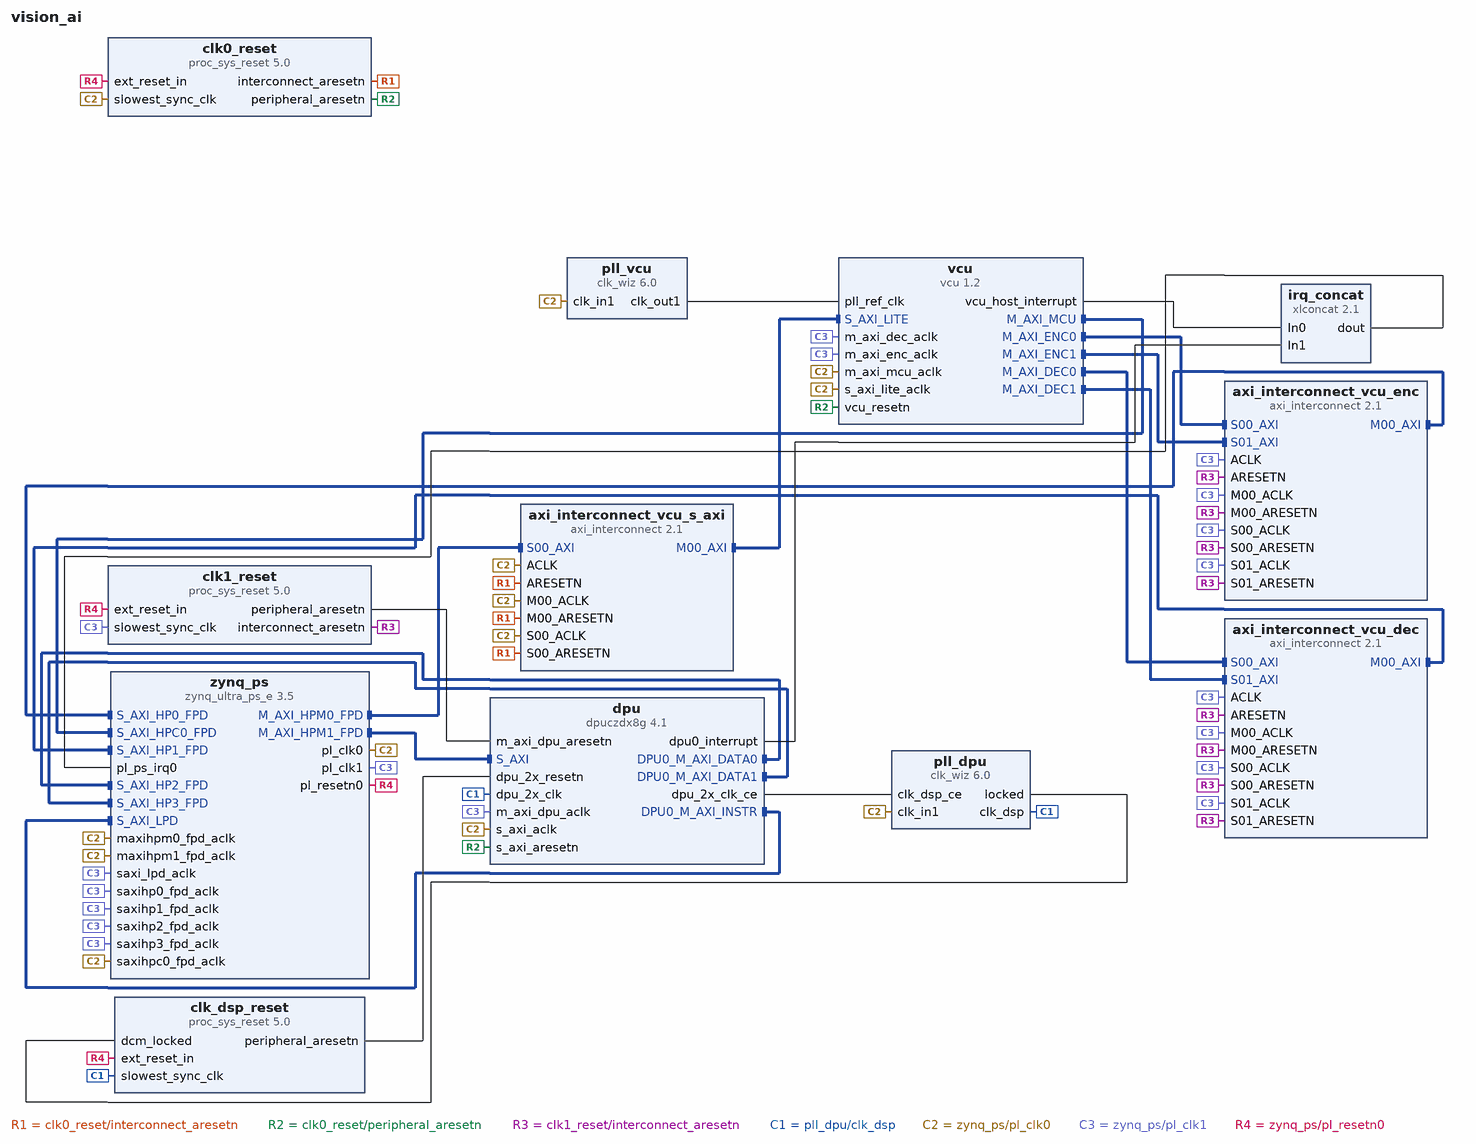
[diagram p0: block diagram of the top level]
# Vivado block design vision_ai, xck26-sfvc784-2LV-c, Vivado 2023.1
create_bd_design vision_ai

create_bd_cell -type ip -vlnv xilinx.com:ip:zynq_ultra_ps_e:3.5 zynq_ps
set_property -dict [list \
  CONFIG.PSU_BANK_0_IO_STANDARD LVCMOS18 \
  CONFIG.PSU_BANK_1_IO_STANDARD LVCMOS18 \
  CONFIG.PSU_BANK_2_IO_STANDARD LVCMOS18 \
  CONFIG.PSU_BANK_3_IO_STANDARD LVCMOS18 \
  CONFIG.PSU_USB3__DUAL_CLOCK_ENABLE 1 \
  CONFIG.PSU__CAN1__PERIPHERAL__ENABLE 0 \
  CONFIG.PSU__CRF_APB__ACPU_CTRL__FREQMHZ 1333.333 \
  CONFIG.PSU__CRF_APB__ACPU_CTRL__SRCSEL APLL \
  CONFIG.PSU__CRF_APB__APLL_CTRL__SRCSEL PSS_REF_CLK \
  CONFIG.PSU__CRF_APB__APLL_FRAC_CFG__ENABLED 1 \
  CONFIG.PSU__CRF_APB__DBG_FPD_CTRL__FREQMHZ 250 \
  CONFIG.PSU__CRF_APB__DBG_FPD_CTRL__SRCSEL IOPLL \
  CONFIG.PSU__CRF_APB__DBG_TRACE_CTRL__FREQMHZ 250 \
  CONFIG.PSU__CRF_APB__DBG_TRACE_CTRL__SRCSEL IOPLL \
  CONFIG.PSU__CRF_APB__DBG_TSTMP_CTRL__FREQMHZ 250 \
  CONFIG.PSU__CRF_APB__DBG_TSTMP_CTRL__SRCSEL IOPLL \
  CONFIG.PSU__CRF_APB__DDR_CTRL__FREQMHZ 1200 \
  CONFIG.PSU__CRF_APB__DDR_CTRL__SRCSEL DPLL \
  CONFIG.PSU__CRF_APB__DPDMA_REF_CTRL__FREQMHZ 600 \
  CONFIG.PSU__CRF_APB__DPDMA_REF_CTRL__SRCSEL APLL \
  CONFIG.PSU__CRF_APB__DPLL_CTRL__SRCSEL PSS_REF_CLK \
  CONFIG.PSU__CRF_APB__DP_AUDIO_REF_CTRL__SRCSEL RPLL \
  CONFIG.PSU__CRF_APB__DP_STC_REF_CTRL__SRCSEL RPLL \
  CONFIG.PSU__CRF_APB__DP_VIDEO_REF_CTRL__SRCSEL VPLL \
  CONFIG.PSU__CRF_APB__GDMA_REF_CTRL__FREQMHZ 600 \
  CONFIG.PSU__CRF_APB__GDMA_REF_CTRL__SRCSEL DPLL \
  CONFIG.PSU__CRF_APB__GPU_REF_CTRL__FREQMHZ 600 \
  CONFIG.PSU__CRF_APB__GPU_REF_CTRL__SRCSEL IOPLL \
  CONFIG.PSU__CRF_APB__TOPSW_LSBUS_CTRL__FREQMHZ 100 \
  CONFIG.PSU__CRF_APB__TOPSW_LSBUS_CTRL__SRCSEL IOPLL \
  CONFIG.PSU__CRF_APB__TOPSW_MAIN_CTRL__FREQMHZ 533.33 \
  CONFIG.PSU__CRF_APB__TOPSW_MAIN_CTRL__SRCSEL DPLL \
  CONFIG.PSU__CRF_APB__VPLL_CTRL__SRCSEL PSS_REF_CLK \
  CONFIG.PSU__CRL_APB__ADMA_REF_CTRL__FREQMHZ 500 \
  CONFIG.PSU__CRL_APB__ADMA_REF_CTRL__SRCSEL IOPLL \
  CONFIG.PSU__CRL_APB__CAN1_REF_CTRL__SRCSEL IOPLL \
  CONFIG.PSU__CRL_APB__CPU_R5_CTRL__FREQMHZ 533.333 \
  CONFIG.PSU__CRL_APB__CPU_R5_CTRL__SRCSEL RPLL \
  CONFIG.PSU__CRL_APB__DBG_LPD_CTRL__FREQMHZ 250 \
  CONFIG.PSU__CRL_APB__DBG_LPD_CTRL__SRCSEL IOPLL \
  CONFIG.PSU__CRL_APB__GEM3_REF_CTRL__FREQMHZ 125 \
  CONFIG.PSU__CRL_APB__GEM3_REF_CTRL__SRCSEL IOPLL \
  CONFIG.PSU__CRL_APB__I2C1_REF_CTRL__FREQMHZ 100 \
  CONFIG.PSU__CRL_APB__I2C1_REF_CTRL__SRCSEL IOPLL \
  CONFIG.PSU__CRL_APB__IOPLL_CTRL__SRCSEL PSS_REF_CLK \
  CONFIG.PSU__CRL_APB__IOU_SWITCH_CTRL__FREQMHZ 250 \
  CONFIG.PSU__CRL_APB__IOU_SWITCH_CTRL__SRCSEL IOPLL \
  CONFIG.PSU__CRL_APB__LPD_LSBUS_CTRL__FREQMHZ 100 \
  CONFIG.PSU__CRL_APB__LPD_LSBUS_CTRL__SRCSEL IOPLL \
  CONFIG.PSU__CRL_APB__LPD_SWITCH_CTRL__FREQMHZ 500 \
  CONFIG.PSU__CRL_APB__LPD_SWITCH_CTRL__SRCSEL IOPLL \
  CONFIG.PSU__CRL_APB__PCAP_CTRL__FREQMHZ 200 \
  CONFIG.PSU__CRL_APB__PCAP_CTRL__SRCSEL IOPLL \
  CONFIG.PSU__CRL_APB__PL0_REF_CTRL__FREQMHZ 100 \
  CONFIG.PSU__CRL_APB__PL0_REF_CTRL__SRCSEL IOPLL \
  CONFIG.PSU__CRL_APB__PL1_REF_CTRL__FREQMHZ 250 \
  CONFIG.PSU__CRL_APB__PL1_REF_CTRL__SRCSEL IOPLL \
  CONFIG.PSU__CRL_APB__QSPI_REF_CTRL__FREQMHZ 125 \
  CONFIG.PSU__CRL_APB__QSPI_REF_CTRL__SRCSEL IOPLL \
  CONFIG.PSU__CRL_APB__RPLL_CTRL__SRCSEL PSS_REF_CLK \
  CONFIG.PSU__CRL_APB__SDIO1_REF_CTRL__FREQMHZ 200 \
  CONFIG.PSU__CRL_APB__SDIO1_REF_CTRL__SRCSEL IOPLL \
  CONFIG.PSU__CRL_APB__SPI1_REF_CTRL__SRCSEL IOPLL \
  CONFIG.PSU__CRL_APB__TIMESTAMP_REF_CTRL__FREQMHZ 100 \
  CONFIG.PSU__CRL_APB__TIMESTAMP_REF_CTRL__SRCSEL IOPLL \
  CONFIG.PSU__CRL_APB__UART1_REF_CTRL__FREQMHZ 100 \
  CONFIG.PSU__CRL_APB__UART1_REF_CTRL__SRCSEL IOPLL \
  CONFIG.PSU__CRL_APB__USB0_BUS_REF_CTRL__FREQMHZ 250 \
  CONFIG.PSU__CRL_APB__USB0_BUS_REF_CTRL__SRCSEL IOPLL \
  CONFIG.PSU__CRL_APB__USB3_DUAL_REF_CTRL__FREQMHZ 20 \
  CONFIG.PSU__CRL_APB__USB3_DUAL_REF_CTRL__SRCSEL IOPLL \
  CONFIG.PSU__CRL_APB__USB3__ENABLE 1 \
  CONFIG.PSU__CSUPMU__PERIPHERAL__VALID 1 \
  CONFIG.PSU__DDRC__BUS_WIDTH {64 Bit} \
  CONFIG.PSU__DDRC__COMPONENTS Components \
  CONFIG.PSU__DDRC__DEVICE_CAPACITY {8192 MBits} \
  CONFIG.PSU__DDRC__DRAM_WIDTH {16 Bits} \
  CONFIG.PSU__DDRC__ECC Disabled \
  CONFIG.PSU__DDRC__MEMORY_TYPE {DDR 4} \
  CONFIG.PSU__DDRC__SPEED_BIN DDR4_2400R \
  CONFIG.PSU__DDR_HIGH_ADDRESS_GUI_ENABLE 1 \
  CONFIG.PSU__DDR__INTERFACE__FREQMHZ 600.000 \
  CONFIG.PSU__DISPLAYPORT__LANE0__ENABLE 1 \
  CONFIG.PSU__DISPLAYPORT__LANE0__IO {GT Lane1} \
  CONFIG.PSU__DISPLAYPORT__LANE1__ENABLE 1 \
  CONFIG.PSU__DISPLAYPORT__LANE1__IO {GT Lane0} \
  CONFIG.PSU__DISPLAYPORT__PERIPHERAL__ENABLE 1 \
  CONFIG.PSU__DLL__ISUSED 1 \
  CONFIG.PSU__DPAUX__PERIPHERAL__ENABLE 1 \
  CONFIG.PSU__DPAUX__PERIPHERAL__IO {MIO 27 .. 30} \
  CONFIG.PSU__DP__LANE_SEL {Dual Lower} \
  CONFIG.PSU__DP__REF_CLK_FREQ 27 \
  CONFIG.PSU__DP__REF_CLK_SEL {Ref Clk0} \
  CONFIG.PSU__ENET3__FIFO__ENABLE 0 \
  CONFIG.PSU__ENET3__GRP_MDIO__ENABLE 1 \
  CONFIG.PSU__ENET3__GRP_MDIO__IO {MIO 76 .. 77} \
  CONFIG.PSU__ENET3__PERIPHERAL__ENABLE 1 \
  CONFIG.PSU__ENET3__PERIPHERAL__IO {MIO 64 .. 75} \
  CONFIG.PSU__ENET3__PTP__ENABLE 0 \
  CONFIG.PSU__ENET3__TSU__ENABLE 0 \
  CONFIG.PSU__FPGA_PL0_ENABLE 1 \
  CONFIG.PSU__FPGA_PL1_ENABLE 1 \
  CONFIG.PSU__GEM3_COHERENCY 0 \
  CONFIG.PSU__GEM3_ROUTE_THROUGH_FPD 0 \
  CONFIG.PSU__GEM__TSU__ENABLE 0 \
  CONFIG.PSU__GPIO0_MIO__IO {MIO 0 .. 25} \
  CONFIG.PSU__GPIO0_MIO__PERIPHERAL__ENABLE 1 \
  CONFIG.PSU__GPIO1_MIO__IO {MIO 26 .. 51} \
  CONFIG.PSU__GPIO1_MIO__PERIPHERAL__ENABLE 1 \
  CONFIG.PSU__GT__LINK_SPEED HBR \
  CONFIG.PSU__GT__PRE_EMPH_LVL_4 0 \
  CONFIG.PSU__GT__VLT_SWNG_LVL_4 0 \
  CONFIG.PSU__I2C0__PERIPHERAL__ENABLE 0 \
  CONFIG.PSU__I2C1__PERIPHERAL__ENABLE 1 \
  CONFIG.PSU__I2C1__PERIPHERAL__IO {MIO 24 .. 25} \
  CONFIG.PSU__IOU_SLCR__IOU_TTC_APB_CLK__TTC0_SEL APB \
  CONFIG.PSU__IOU_SLCR__IOU_TTC_APB_CLK__TTC1_SEL APB \
  CONFIG.PSU__IOU_SLCR__IOU_TTC_APB_CLK__TTC2_SEL APB \
  CONFIG.PSU__IOU_SLCR__IOU_TTC_APB_CLK__TTC3_SEL APB \
  CONFIG.PSU__MAXIGP0__DATA_WIDTH 32 \
  CONFIG.PSU__MAXIGP1__DATA_WIDTH 32 \
  CONFIG.PSU__OVERRIDE__BASIC_CLOCK 0 \
  CONFIG.PSU__PMU_COHERENCY 0 \
  CONFIG.PSU__PMU__AIBACK__ENABLE 0 \
  CONFIG.PSU__PMU__EMIO_GPI__ENABLE 0 \
  CONFIG.PSU__PMU__EMIO_GPO__ENABLE 0 \
  CONFIG.PSU__PMU__GPI0__ENABLE 1 \
  CONFIG.PSU__PMU__GPI0__IO {MIO 26} \
  CONFIG.PSU__PMU__GPI1__ENABLE 0 \
  CONFIG.PSU__PMU__GPI2__ENABLE 0 \
  CONFIG.PSU__PMU__GPI3__ENABLE 0 \
  CONFIG.PSU__PMU__GPI4__ENABLE 0 \
  CONFIG.PSU__PMU__GPI5__ENABLE 1 \
  CONFIG.PSU__PMU__GPI5__IO {MIO 31} \
  CONFIG.PSU__PMU__GPO0__ENABLE 0 \
  CONFIG.PSU__PMU__GPO1__ENABLE 0 \
  CONFIG.PSU__PMU__GPO2__ENABLE 0 \
  CONFIG.PSU__PMU__GPO3__ENABLE 1 \
  CONFIG.PSU__PMU__GPO3__IO {MIO 35} \
  CONFIG.PSU__PMU__GPO3__POLARITY low \
  CONFIG.PSU__PMU__GPO4__ENABLE 0 \
  CONFIG.PSU__PMU__GPO5__ENABLE 0 \
  CONFIG.PSU__PMU__PERIPHERAL__ENABLE 1 \
  CONFIG.PSU__PMU__PLERROR__ENABLE 0 \
  CONFIG.PSU__PRESET_APPLIED 1 \
  CONFIG.PSU__PSS_REF_CLK__FREQMHZ 33.333 \
  CONFIG.PSU__QSPI_COHERENCY 0 \
  CONFIG.PSU__QSPI_ROUTE_THROUGH_FPD 0 \
  CONFIG.PSU__QSPI__GRP_FBCLK__ENABLE 0 \
  CONFIG.PSU__QSPI__PERIPHERAL__DATA_MODE x4 \
  CONFIG.PSU__QSPI__PERIPHERAL__ENABLE 1 \
  CONFIG.PSU__QSPI__PERIPHERAL__IO {MIO 0 .. 5} \
  CONFIG.PSU__QSPI__PERIPHERAL__MODE Single \
  CONFIG.PSU__SAXIGP0__DATA_WIDTH 32 \
  CONFIG.PSU__SAXIGP6__DATA_WIDTH 32 \
  CONFIG.PSU__SD1_COHERENCY 0 \
  CONFIG.PSU__SD1_ROUTE_THROUGH_FPD 0 \
  CONFIG.PSU__SD1__CLK_100_SDR_OTAP_DLY 0x3 \
  CONFIG.PSU__SD1__CLK_200_SDR_OTAP_DLY 0x3 \
  CONFIG.PSU__SD1__CLK_50_DDR_ITAP_DLY 0x3D \
  CONFIG.PSU__SD1__CLK_50_DDR_OTAP_DLY 0x4 \
  CONFIG.PSU__SD1__CLK_50_SDR_ITAP_DLY 0x15 \
  CONFIG.PSU__SD1__CLK_50_SDR_OTAP_DLY 0x5 \
  CONFIG.PSU__SD1__DATA_TRANSFER_MODE 8Bit \
  CONFIG.PSU__SD1__GRP_CD__ENABLE 1 \
  CONFIG.PSU__SD1__GRP_CD__IO {MIO 45} \
  CONFIG.PSU__SD1__GRP_POW__ENABLE 1 \
  CONFIG.PSU__SD1__GRP_POW__IO {MIO 43} \
  CONFIG.PSU__SD1__GRP_WP__ENABLE 0 \
  CONFIG.PSU__SD1__PERIPHERAL__ENABLE 1 \
  CONFIG.PSU__SD1__PERIPHERAL__IO {MIO 39 .. 51} \
  CONFIG.PSU__SD1__SLOT_TYPE {SD 3.0} \
  CONFIG.PSU__SPI1__GRP_SS0__IO {MIO 9} \
  CONFIG.PSU__SPI1__PERIPHERAL__ENABLE 1 \
  CONFIG.PSU__SPI1__PERIPHERAL__IO {MIO 6 .. 11} \
  CONFIG.PSU__SWDT0__CLOCK__ENABLE 0 \
  CONFIG.PSU__SWDT0__PERIPHERAL__ENABLE 1 \
  CONFIG.PSU__SWDT0__RESET__ENABLE 0 \
  CONFIG.PSU__SWDT1__CLOCK__ENABLE 0 \
  CONFIG.PSU__SWDT1__PERIPHERAL__ENABLE 1 \
  CONFIG.PSU__SWDT1__RESET__ENABLE 0 \
  CONFIG.PSU__TSU__BUFG_PORT_PAIR 0 \
  CONFIG.PSU__TTC0__CLOCK__ENABLE 0 \
  CONFIG.PSU__TTC0__PERIPHERAL__ENABLE 1 \
  CONFIG.PSU__TTC0__WAVEOUT__ENABLE 0 \
  CONFIG.PSU__TTC1__CLOCK__ENABLE 0 \
  CONFIG.PSU__TTC1__PERIPHERAL__ENABLE 1 \
  CONFIG.PSU__TTC1__WAVEOUT__ENABLE 0 \
  CONFIG.PSU__TTC2__CLOCK__ENABLE 0 \
  CONFIG.PSU__TTC2__PERIPHERAL__ENABLE 1 \
  CONFIG.PSU__TTC2__WAVEOUT__ENABLE 0 \
  CONFIG.PSU__TTC3__CLOCK__ENABLE 0 \
  CONFIG.PSU__TTC3__PERIPHERAL__ENABLE 1 \
  CONFIG.PSU__TTC3__WAVEOUT__ENABLE 0 \
  CONFIG.PSU__UART1__BAUD_RATE 115200 \
  CONFIG.PSU__UART1__MODEM__ENABLE 0 \
  CONFIG.PSU__UART1__PERIPHERAL__ENABLE 1 \
  CONFIG.PSU__UART1__PERIPHERAL__IO {MIO 36 .. 37} \
  CONFIG.PSU__USB0_COHERENCY 0 \
  CONFIG.PSU__USB0__PERIPHERAL__ENABLE 1 \
  CONFIG.PSU__USB0__PERIPHERAL__IO {MIO 52 .. 63} \
  CONFIG.PSU__USB0__REF_CLK_FREQ 26 \
  CONFIG.PSU__USB0__REF_CLK_SEL {Ref Clk1} \
  CONFIG.PSU__USB2_0__EMIO__ENABLE 0 \
  CONFIG.PSU__USB3_0__EMIO__ENABLE 0 \
  CONFIG.PSU__USB3_0__PERIPHERAL__ENABLE 1 \
  CONFIG.PSU__USB3_0__PERIPHERAL__IO {GT Lane2} \
  CONFIG.PSU__USB__RESET__MODE {Boot Pin} \
  CONFIG.PSU__USB__RESET__POLARITY {Active Low} \
  CONFIG.PSU__USE__IRQ0 1 \
  CONFIG.PSU__USE__M_AXI_GP0 1 \
  CONFIG.PSU__USE__M_AXI_GP1 1 \
  CONFIG.PSU__USE__M_AXI_GP2 0 \
  CONFIG.PSU__USE__S_AXI_GP0 1 \
  CONFIG.PSU__USE__S_AXI_GP2 1 \
  CONFIG.PSU__USE__S_AXI_GP3 1 \
  CONFIG.PSU__USE__S_AXI_GP4 1 \
  CONFIG.PSU__USE__S_AXI_GP5 1 \
  CONFIG.PSU__USE__S_AXI_GP6 1 \
] [get_bd_cells zynq_ps]
# 244 more settings of zynq_ps are not shown: defaults, MIO pin electricals, DDR timing, and values the tool derives
create_bd_cell -type ip -vlnv xilinx.com:ip:vcu:1.2 vcu
create_bd_cell -type ip -vlnv xilinx.com:ip:proc_sys_reset:5.0 clk0_reset
create_bd_cell -type ip -vlnv xilinx.com:ip:proc_sys_reset:5.0 clk1_reset
create_bd_cell -type ip -vlnv xilinx.com:ip:clk_wiz:6.0 pll_vcu
set_property -dict [list \
  CONFIG.CLKOUT1_JITTER 219.032 \
  CONFIG.CLKOUT1_PHASE_ERROR 306.676 \
  CONFIG.CLKOUT1_REQUESTED_OUT_FREQ 59 \
  CONFIG.MMCM_CLKFBOUT_MULT_F 87.250 \
  CONFIG.MMCM_CLKOUT0_DIVIDE_F 21.125 \
  CONFIG.MMCM_DIVCLK_DIVIDE 7 \
  CONFIG.USE_LOCKED false \
  CONFIG.USE_RESET false \
] [get_bd_cells pll_vcu]
create_bd_cell -type ip -vlnv xilinx.com:ip:axi_interconnect:2.1 axi_interconnect_vcu_enc
set_property -dict {CONFIG.NUM_MI 1 CONFIG.NUM_SI 2} [get_bd_cells axi_interconnect_vcu_enc]
create_bd_cell -type ip -vlnv xilinx.com:ip:axi_interconnect:2.1 axi_interconnect_vcu_dec
set_property -dict {CONFIG.NUM_MI 1 CONFIG.NUM_SI 2} [get_bd_cells axi_interconnect_vcu_dec]
create_bd_cell -type ip -vlnv xilinx.com:ip:dpuczdx8g:4.1 dpu
set_property -dict [list \
  CONFIG.CLK_GATING_ENA 1 \
  CONFIG.SFM_ENA 0 \
  CONFIG.TIME_DAY 1 \
  CONFIG.TIME_HOUR 23 \
  CONFIG.TIME_MONTH 11 \
  CONFIG.TIME_QUARTER 2 \
  CONFIG.TIME_YEAR 25 \
  CONFIG.URAM_N_USER 64 \
] [get_bd_cells dpu]
create_bd_cell -type ip -vlnv xilinx.com:ip:proc_sys_reset:5.0 clk_dsp_reset
create_bd_cell -type ip -vlnv xilinx.com:ip:clk_wiz:6.0 pll_dpu
set_property -dict [list \
  CONFIG.CLKOUT1_DRIVES Buffer_with_CE \
  CONFIG.CLKOUT1_JITTER 97.083 \
  CONFIG.CLKOUT1_PHASE_ERROR 98.576 \
  CONFIG.CLKOUT1_REQUESTED_OUT_FREQ 500.000 \
  CONFIG.CLKOUT2_DRIVES Buffer_with_CE \
  CONFIG.CLKOUT2_JITTER 97.083 \
  CONFIG.CLKOUT2_PHASE_ERROR 98.576 \
  CONFIG.CLKOUT2_REQUESTED_OUT_FREQ 500.000 \
  CONFIG.CLKOUT2_USED false \
  CONFIG.CLK_OUT1_PORT clk_dsp \
  CONFIG.CLK_OUT2_PORT clk_dsp \
  CONFIG.FEEDBACK_SOURCE FDBK_AUTO \
  CONFIG.MMCM_CLKFBOUT_MULT_F 10.000 \
  CONFIG.MMCM_CLKOUT0_DIVIDE_F 2.000 \
  CONFIG.MMCM_CLKOUT1_DIVIDE 1 \
  CONFIG.NUM_OUT_CLKS 1 \
  CONFIG.USE_RESET false \
] [get_bd_cells pll_dpu]
create_bd_cell -type ip -vlnv xilinx.com:ip:xlconcat:2.1 irq_concat
set_property -dict {CONFIG.NUM_PORTS 2} [get_bd_cells irq_concat]
create_bd_cell -type ip -vlnv xilinx.com:ip:axi_interconnect:2.1 axi_interconnect_vcu_s_axi
set_property -dict {CONFIG.NUM_MI 1} [get_bd_cells axi_interconnect_vcu_s_axi]

# ---- connections ----

connect_bd_intf_net -intf_net axi_interconnect_0_M00_AXI [get_bd_intf_pins axi_interconnect_vcu_enc/M00_AXI] [get_bd_intf_pins zynq_ps/S_AXI_HP0_FPD]
connect_bd_intf_net -intf_net axi_interconnect_1_M00_AXI [get_bd_intf_pins axi_interconnect_vcu_dec/M00_AXI] [get_bd_intf_pins zynq_ps/S_AXI_HP1_FPD]
connect_bd_intf_net [get_bd_intf_pins axi_interconnect_vcu_s_axi/M00_AXI] [get_bd_intf_pins vcu/S_AXI_LITE]
connect_bd_intf_net [get_bd_intf_pins dpu/DPU0_M_AXI_DATA0] [get_bd_intf_pins zynq_ps/S_AXI_HP2_FPD]
connect_bd_intf_net [get_bd_intf_pins dpu/DPU0_M_AXI_DATA1] [get_bd_intf_pins zynq_ps/S_AXI_HP3_FPD]
connect_bd_intf_net [get_bd_intf_pins dpu/DPU0_M_AXI_INSTR] [get_bd_intf_pins zynq_ps/S_AXI_LPD]
connect_bd_intf_net -intf_net vcu_0_M_AXI_DEC0 [get_bd_intf_pins vcu/M_AXI_DEC0] [get_bd_intf_pins axi_interconnect_vcu_dec/S00_AXI]
connect_bd_intf_net -intf_net vcu_0_M_AXI_DEC1 [get_bd_intf_pins vcu/M_AXI_DEC1] [get_bd_intf_pins axi_interconnect_vcu_dec/S01_AXI]
connect_bd_intf_net -intf_net vcu_0_M_AXI_ENC0 [get_bd_intf_pins vcu/M_AXI_ENC0] [get_bd_intf_pins axi_interconnect_vcu_enc/S00_AXI]
connect_bd_intf_net -intf_net vcu_0_M_AXI_ENC1 [get_bd_intf_pins vcu/M_AXI_ENC1] [get_bd_intf_pins axi_interconnect_vcu_enc/S01_AXI]
connect_bd_intf_net -intf_net vcu_0_M_AXI_MCU [get_bd_intf_pins zynq_ps/S_AXI_HPC0_FPD] [get_bd_intf_pins vcu/M_AXI_MCU]
connect_bd_intf_net [get_bd_intf_pins zynq_ps/M_AXI_HPM0_FPD] [get_bd_intf_pins axi_interconnect_vcu_s_axi/S00_AXI]
connect_bd_intf_net [get_bd_intf_pins dpu/S_AXI] [get_bd_intf_pins zynq_ps/M_AXI_HPM1_FPD]
connect_bd_net -net ARESETN_1 [get_bd_pins clk0_reset/interconnect_aresetn] \
  [get_bd_pins axi_interconnect_vcu_s_axi/ARESETN] [get_bd_pins axi_interconnect_vcu_s_axi/S00_ARESETN] \
  [get_bd_pins axi_interconnect_vcu_s_axi/M00_ARESETN]
connect_bd_net [get_bd_pins clk0_reset/peripheral_aresetn] [get_bd_pins vcu/vcu_resetn] [get_bd_pins dpu/s_axi_aresetn]
connect_bd_net [get_bd_pins clk1_reset/interconnect_aresetn] \
  [get_bd_pins axi_interconnect_vcu_enc/ARESETN] [get_bd_pins axi_interconnect_vcu_enc/S00_ARESETN] \
  [get_bd_pins axi_interconnect_vcu_enc/M00_ARESETN] [get_bd_pins axi_interconnect_vcu_enc/S01_ARESETN] \
  [get_bd_pins axi_interconnect_vcu_dec/ARESETN] [get_bd_pins axi_interconnect_vcu_dec/S00_ARESETN] \
  [get_bd_pins axi_interconnect_vcu_dec/M00_ARESETN] [get_bd_pins axi_interconnect_vcu_dec/S01_ARESETN]
connect_bd_net [get_bd_pins clk1_reset/peripheral_aresetn] [get_bd_pins dpu/m_axi_dpu_aresetn]
connect_bd_net [get_bd_pins clk_dsp_reset/peripheral_aresetn] [get_bd_pins dpu/dpu_2x_resetn]
connect_bd_net -net clk_wiz_0_clk_out1 [get_bd_pins pll_vcu/clk_out1] [get_bd_pins vcu/pll_ref_clk]
connect_bd_net [get_bd_pins dpu/dpu0_interrupt] [get_bd_pins irq_concat/In1]
connect_bd_net [get_bd_pins dpu/dpu_2x_clk_ce] [get_bd_pins pll_dpu/clk_dsp_ce]
connect_bd_net [get_bd_pins pll_dpu/locked] [get_bd_pins clk_dsp_reset/dcm_locked]
connect_bd_net -net vcu_0_vcu_host_interrupt [get_bd_pins vcu/vcu_host_interrupt] [get_bd_pins irq_concat/In0]
connect_bd_net -net xlconcat_0_dout [get_bd_pins irq_concat/dout] [get_bd_pins zynq_ps/pl_ps_irq0]
connect_bd_net -net zynq_ps_pl_clk3 [get_bd_pins pll_dpu/clk_dsp] [get_bd_pins clk_dsp_reset/slowest_sync_clk] [get_bd_pins dpu/dpu_2x_clk]
connect_bd_net -net zynq_ultra_ps_e_0_pl_clk0 [get_bd_pins zynq_ps/pl_clk0] \
  [get_bd_pins zynq_ps/saxihpc0_fpd_aclk] [get_bd_pins clk0_reset/slowest_sync_clk] [get_bd_pins vcu/m_axi_mcu_aclk] \
  [get_bd_pins pll_vcu/clk_in1] [get_bd_pins vcu/s_axi_lite_aclk] [get_bd_pins dpu/s_axi_aclk] [get_bd_pins pll_dpu/clk_in1] \
  [get_bd_pins zynq_ps/maxihpm1_fpd_aclk] [get_bd_pins zynq_ps/maxihpm0_fpd_aclk] \
  [get_bd_pins axi_interconnect_vcu_s_axi/ACLK] [get_bd_pins axi_interconnect_vcu_s_axi/S00_ACLK] \
  [get_bd_pins axi_interconnect_vcu_s_axi/M00_ACLK]
connect_bd_net -net zynq_ultra_ps_e_0_pl_clk1 [get_bd_pins zynq_ps/pl_clk1] \
  [get_bd_pins zynq_ps/saxihp0_fpd_aclk] [get_bd_pins zynq_ps/saxihp1_fpd_aclk] [get_bd_pins vcu/m_axi_dec_aclk] \
  [get_bd_pins axi_interconnect_vcu_enc/M00_ACLK] [get_bd_pins axi_interconnect_vcu_enc/S01_ACLK] \
  [get_bd_pins axi_interconnect_vcu_enc/S00_ACLK] [get_bd_pins axi_interconnect_vcu_enc/ACLK] \
  [get_bd_pins axi_interconnect_vcu_dec/ACLK] [get_bd_pins axi_interconnect_vcu_dec/S00_ACLK] \
  [get_bd_pins axi_interconnect_vcu_dec/M00_ACLK] [get_bd_pins axi_interconnect_vcu_dec/S01_ACLK] \
  [get_bd_pins clk1_reset/slowest_sync_clk] [get_bd_pins vcu/m_axi_enc_aclk] [get_bd_pins dpu/m_axi_dpu_aclk] \
  [get_bd_pins zynq_ps/saxihp2_fpd_aclk] [get_bd_pins zynq_ps/saxihp3_fpd_aclk] [get_bd_pins zynq_ps/saxi_lpd_aclk]
connect_bd_net -net zynq_ultra_ps_e_0_pl_resetn0 [get_bd_pins zynq_ps/pl_resetn0] \
  [get_bd_pins clk1_reset/ext_reset_in] [get_bd_pins clk0_reset/ext_reset_in] [get_bd_pins clk_dsp_reset/ext_reset_in]

# ---- address map ----
assign_bd_address -offset 0x0000000000 -range 2G -target_address_space [get_bd_addr_spaces dpu/DPU0_M_AXI_DATA0] [get_bd_addr_segs zynq_ps/SAXIGP4/HP2_DDR_LOW]
assign_bd_address -offset 0x00C0000000 -range 512M -target_address_space [get_bd_addr_spaces dpu/DPU0_M_AXI_DATA0] [get_bd_addr_segs zynq_ps/SAXIGP4/HP2_QSPI]
assign_bd_address -offset 0x00FF000000 -range 16M -target_address_space [get_bd_addr_spaces dpu/DPU0_M_AXI_DATA0] [get_bd_addr_segs zynq_ps/SAXIGP4/HP2_LPS_OCM]
assign_bd_address -offset 0x0800000000 -range 32G -target_address_space [get_bd_addr_spaces dpu/DPU0_M_AXI_DATA0] [get_bd_addr_segs zynq_ps/SAXIGP4/HP2_DDR_HIGH]
assign_bd_address -offset 0x0000000000 -range 2G -target_address_space [get_bd_addr_spaces dpu/DPU0_M_AXI_DATA1] [get_bd_addr_segs zynq_ps/SAXIGP5/HP3_DDR_LOW]
assign_bd_address -offset 0x00C0000000 -range 512M -target_address_space [get_bd_addr_spaces dpu/DPU0_M_AXI_DATA1] [get_bd_addr_segs zynq_ps/SAXIGP5/HP3_QSPI]
assign_bd_address -offset 0x00FF000000 -range 16M -target_address_space [get_bd_addr_spaces dpu/DPU0_M_AXI_DATA1] [get_bd_addr_segs zynq_ps/SAXIGP5/HP3_LPS_OCM]
assign_bd_address -offset 0x0800000000 -range 32G -target_address_space [get_bd_addr_spaces dpu/DPU0_M_AXI_DATA1] [get_bd_addr_segs zynq_ps/SAXIGP5/HP3_DDR_HIGH]
assign_bd_address -offset 0x0000000000 -range 2G -target_address_space [get_bd_addr_spaces dpu/DPU0_M_AXI_INSTR] [get_bd_addr_segs zynq_ps/SAXIGP6/LPD_DDR_LOW]
assign_bd_address -offset 0x00C0000000 -range 512M -target_address_space [get_bd_addr_spaces dpu/DPU0_M_AXI_INSTR] [get_bd_addr_segs zynq_ps/SAXIGP6/LPD_QSPI]
assign_bd_address -offset 0x00FF000000 -range 16M -target_address_space [get_bd_addr_spaces dpu/DPU0_M_AXI_INSTR] [get_bd_addr_segs zynq_ps/SAXIGP6/LPD_LPS_OCM]
assign_bd_address -offset 0x0800000000 -range 32G -target_address_space [get_bd_addr_spaces dpu/DPU0_M_AXI_INSTR] [get_bd_addr_segs zynq_ps/SAXIGP6/LPD_DDR_HIGH]
assign_bd_address -offset 0x00000000000 -range 2G -target_address_space [get_bd_addr_spaces vcu/Code] [get_bd_addr_segs zynq_ps/SAXIGP0/HPC0_DDR_LOW]
assign_bd_address -offset 0x000C0000000 -range 512M -target_address_space [get_bd_addr_spaces vcu/Code] [get_bd_addr_segs zynq_ps/SAXIGP0/HPC0_QSPI]
assign_bd_address -offset 0x000FF000000 -range 16M -target_address_space [get_bd_addr_spaces vcu/Code] [get_bd_addr_segs zynq_ps/SAXIGP0/HPC0_LPS_OCM]
assign_bd_address -offset 0x00800000000 -range 32G -target_address_space [get_bd_addr_spaces vcu/Code] [get_bd_addr_segs zynq_ps/SAXIGP0/HPC0_DDR_HIGH]
assign_bd_address -offset 0x00000000000 -range 2G -target_address_space [get_bd_addr_spaces vcu/DecData0] [get_bd_addr_segs zynq_ps/SAXIGP3/HP1_DDR_LOW]
assign_bd_address -offset 0x000C0000000 -range 512M -target_address_space [get_bd_addr_spaces vcu/DecData0] [get_bd_addr_segs zynq_ps/SAXIGP3/HP1_QSPI]
assign_bd_address -offset 0x000FF000000 -range 16M -target_address_space [get_bd_addr_spaces vcu/DecData0] [get_bd_addr_segs zynq_ps/SAXIGP3/HP1_LPS_OCM]
assign_bd_address -offset 0x00800000000 -range 32G -target_address_space [get_bd_addr_spaces vcu/DecData0] [get_bd_addr_segs zynq_ps/SAXIGP3/HP1_DDR_HIGH]
assign_bd_address -offset 0x00000000000 -range 2G -target_address_space [get_bd_addr_spaces vcu/DecData1] [get_bd_addr_segs zynq_ps/SAXIGP3/HP1_DDR_LOW]
assign_bd_address -offset 0x000C0000000 -range 512M -target_address_space [get_bd_addr_spaces vcu/DecData1] [get_bd_addr_segs zynq_ps/SAXIGP3/HP1_QSPI]
assign_bd_address -offset 0x000FF000000 -range 16M -target_address_space [get_bd_addr_spaces vcu/DecData1] [get_bd_addr_segs zynq_ps/SAXIGP3/HP1_LPS_OCM]
assign_bd_address -offset 0x00800000000 -range 32G -target_address_space [get_bd_addr_spaces vcu/DecData1] [get_bd_addr_segs zynq_ps/SAXIGP3/HP1_DDR_HIGH]
assign_bd_address -offset 0x00000000000 -range 2G -target_address_space [get_bd_addr_spaces vcu/EncData0] [get_bd_addr_segs zynq_ps/SAXIGP2/HP0_DDR_LOW]
assign_bd_address -offset 0x000C0000000 -range 512M -target_address_space [get_bd_addr_spaces vcu/EncData0] [get_bd_addr_segs zynq_ps/SAXIGP2/HP0_QSPI]
assign_bd_address -offset 0x000FF000000 -range 16M -target_address_space [get_bd_addr_spaces vcu/EncData0] [get_bd_addr_segs zynq_ps/SAXIGP2/HP0_LPS_OCM]
assign_bd_address -offset 0x00800000000 -range 32G -target_address_space [get_bd_addr_spaces vcu/EncData0] [get_bd_addr_segs zynq_ps/SAXIGP2/HP0_DDR_HIGH]
assign_bd_address -offset 0x00000000000 -range 2G -target_address_space [get_bd_addr_spaces vcu/EncData1] [get_bd_addr_segs zynq_ps/SAXIGP2/HP0_DDR_LOW]
assign_bd_address -offset 0x000C0000000 -range 512M -target_address_space [get_bd_addr_spaces vcu/EncData1] [get_bd_addr_segs zynq_ps/SAXIGP2/HP0_QSPI]
assign_bd_address -offset 0x000FF000000 -range 16M -target_address_space [get_bd_addr_spaces vcu/EncData1] [get_bd_addr_segs zynq_ps/SAXIGP2/HP0_LPS_OCM]
assign_bd_address -offset 0x00800000000 -range 32G -target_address_space [get_bd_addr_spaces vcu/EncData1] [get_bd_addr_segs zynq_ps/SAXIGP2/HP0_DDR_HIGH]
assign_bd_address -offset 0x00A0000000 -range 1M -target_address_space [get_bd_addr_spaces zynq_ps/Data] [get_bd_addr_segs vcu/S_AXI_LITE/Reg]
assign_bd_address -offset 0x0500000000 -range 16M -target_address_space [get_bd_addr_spaces zynq_ps/Data] [get_bd_addr_segs dpu/S_AXI/reg0]

validate_bd_design
save_bd_design
